# Altium schematic sheet Digital_Output.SchDoc: TTL Output Card
size Tabloid; Date: 05/10/2023; Engineer: Terry D. Schevker; Revision: 1.0; SheetNumber: 1; SheetTotal: 3
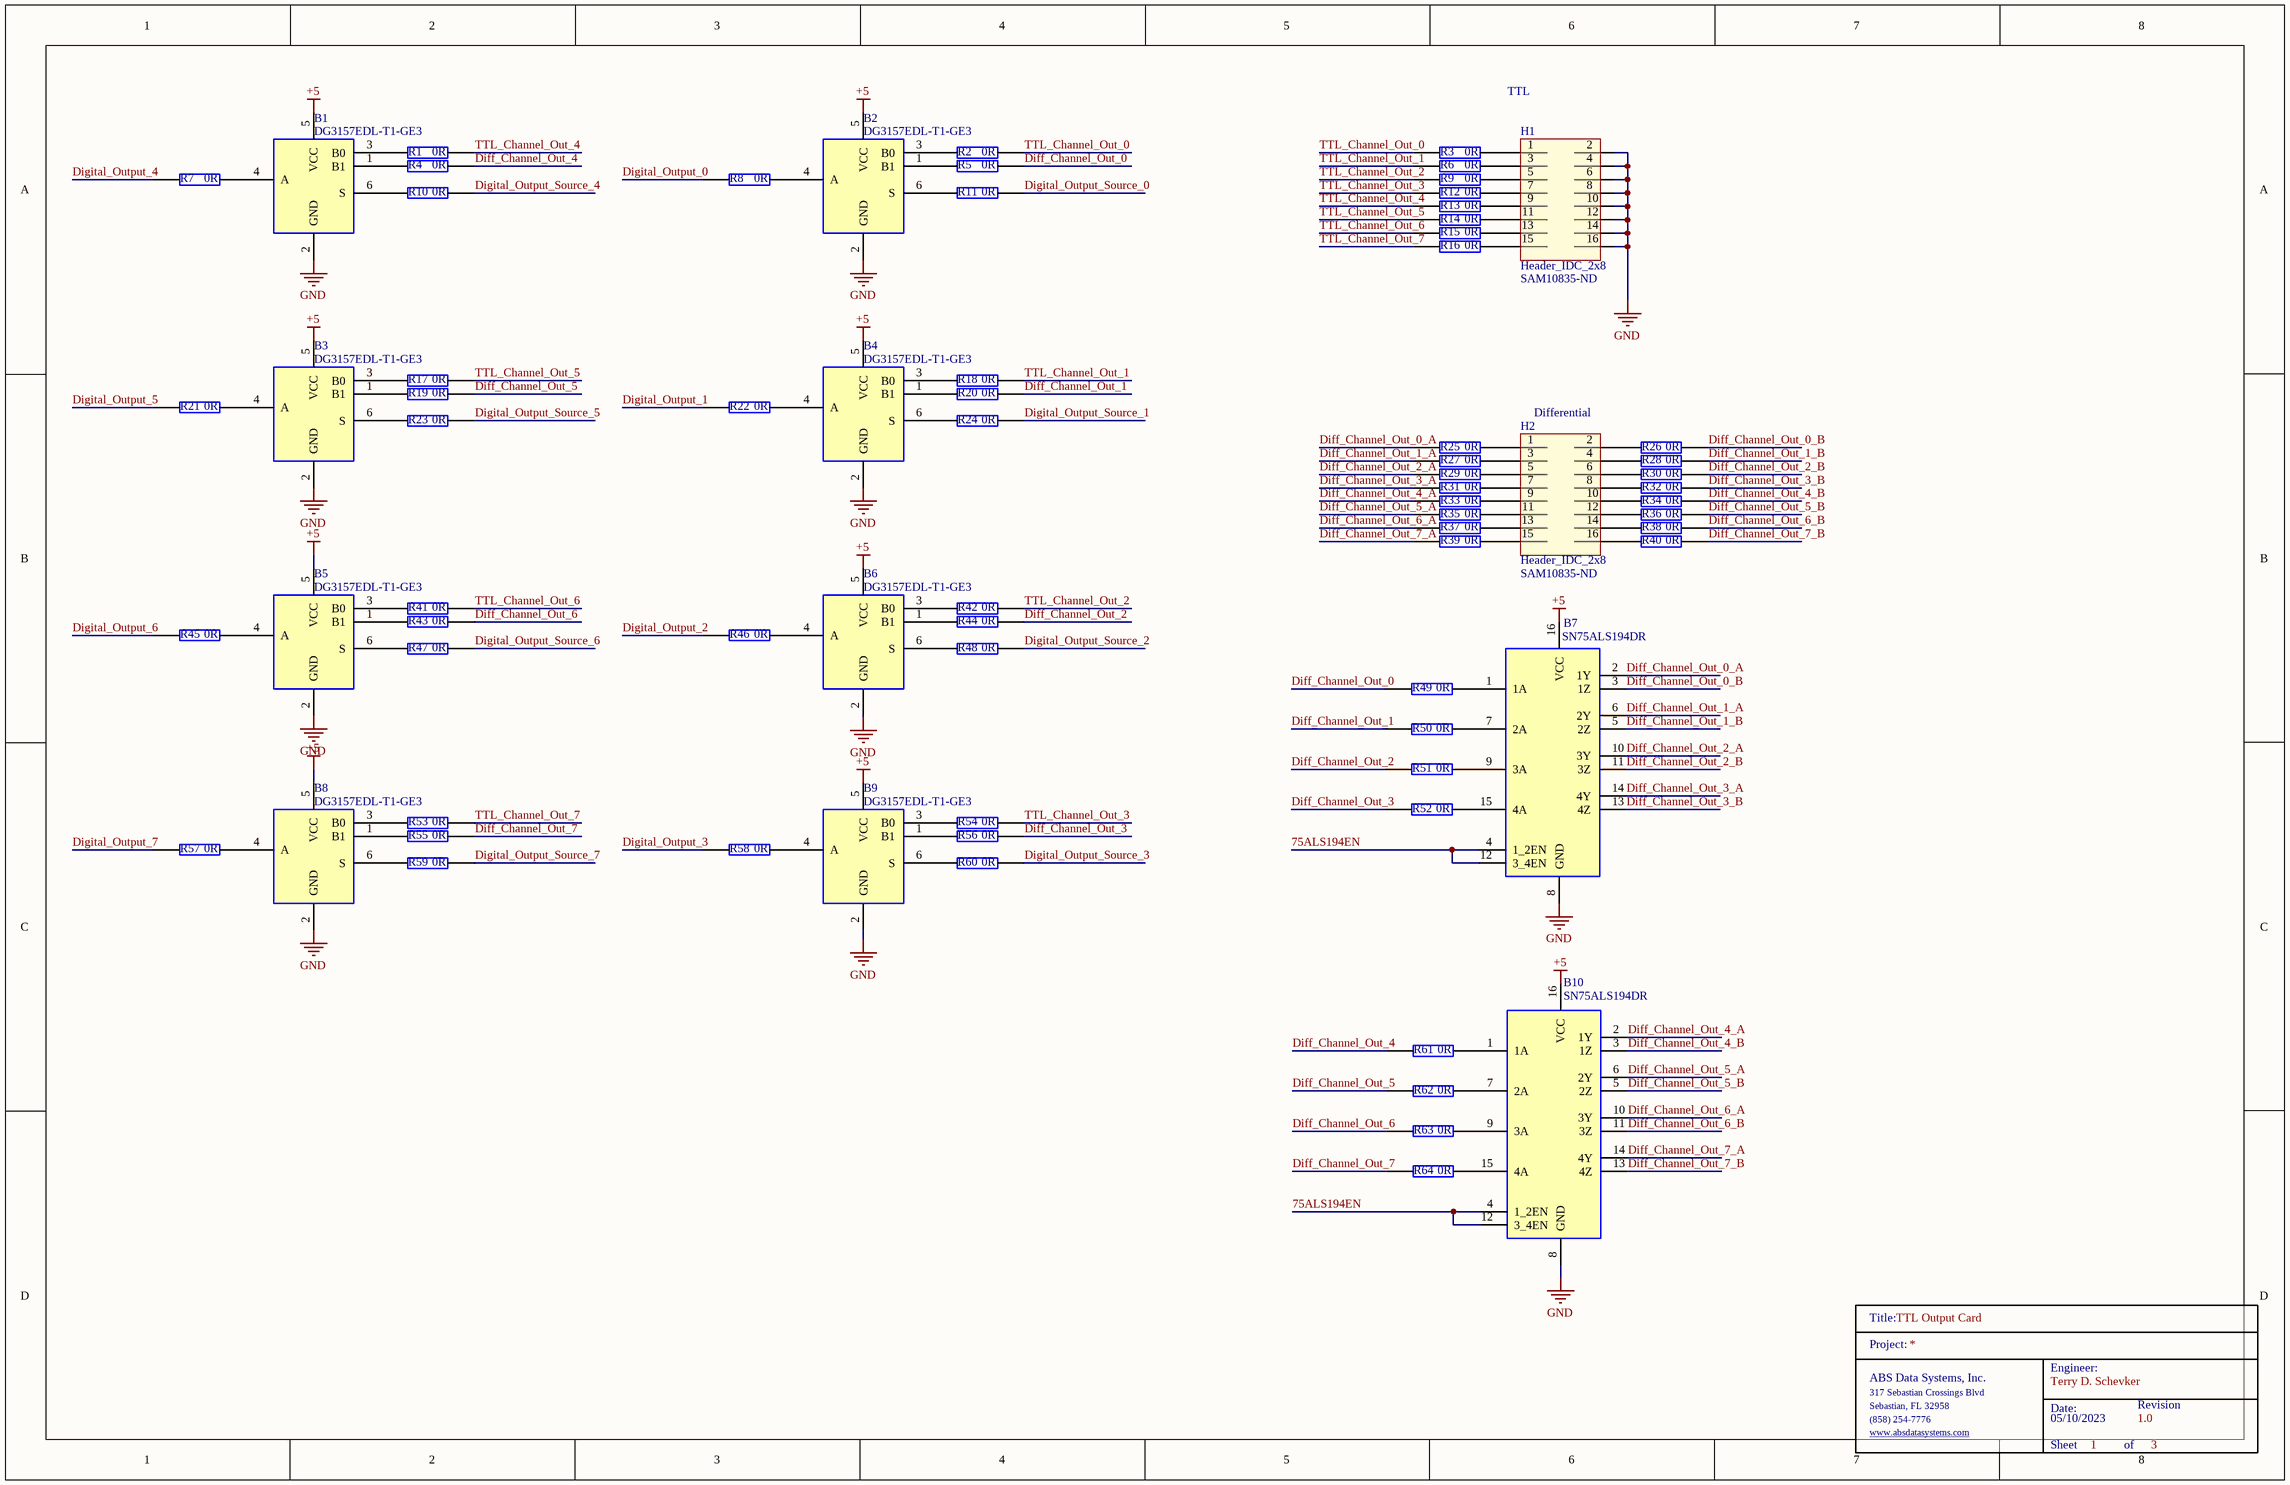
[diagram p0: Digital_Output.SchDoc]

## Parts
B1  DG3157EDL-T1-GE3  [SOT65P210X110-6N]
B2  DG3157EDL-T1-GE3  [SOT65P210X110-6N]
B3  DG3157EDL-T1-GE3  [SOT65P210X110-6N]
B4  DG3157EDL-T1-GE3  [SOT65P210X110-6N]
B5  DG3157EDL-T1-GE3  [SOT65P210X110-6N]
B6  DG3157EDL-T1-GE3  [SOT65P210X110-6N]
B7  SN75ALS194DR  [SOIC127P600X175-16N]
B8  DG3157EDL-T1-GE3  [SOT65P210X110-6N]
B9  DG3157EDL-T1-GE3  [SOT65P210X110-6N]
B10  SN75ALS194DR  [SOIC127P600X175-16N]
H1  Header_IDC_2x8  Supplier Part Number 1: SAM10835-ND  [HDR2X8]
H2  Header_IDC_2x8  Supplier Part Number 1: SAM10835-ND  [HDR2X8]
R1  0R  [0603]
R2  0R  [0603]
R3  0R  [0603]
R4  0R  [0603]
R5  0R  [0603]
R6  0R  [0603]
R7  0R  [0603]
R8  0R  [0603]
R9  0R  [0603]
R10  0R  [0603]
R11  0R  [0603]
R12  0R  [0603]
R13  0R  [0603]
R14  0R  [0603]
R15  0R  [0603]
R16  0R  [0603]
R17  0R  [0603]
R18  0R  [0603]
R19  0R  [0603]
R20  0R  [0603]
R21  0R  [0603]
R22  0R  [0603]
R23  0R  [0603]
R24  0R  [0603]
R25  0R  [0603]
R26  0R  [0603]
R27  0R  [0603]
R28  0R  [0603]
R29  0R  [0603]
R30  0R  [0603]
R31  0R  [0603]
R32  0R  [0603]
R33  0R  [0603]
R34  0R  [0603]
R35  0R  [0603]
R36  0R  [0603]
R37  0R  [0603]
R38  0R  [0603]
R39  0R  [0603]
R40  0R  [0603]
R41  0R  [0603]
R42  0R  [0603]
R43  0R  [0603]
R44  0R  [0603]
R45  0R  [0603]
R46  0R  [0603]
R47  0R  [0603]
R48  0R  [0603]
R49  0R  [0603]
R50  0R  [0603]
R51  0R  [0603]
R52  0R  [0603]
R53  0R  [0603]
R54  0R  [0603]
R55  0R  [0603]
R56  0R  [0603]
R57  0R  [0603]
R58  0R  [0603]
R59  0R  [0603]
R60  0R  [0603]
R61  0R  [0603]
R62  0R  [0603]
R63  0R  [0603]
R64  0R  [0603]
TitleBlock_3  TitleBlock  (value not drawn)  (graphical)

## Nets
+5: B1.5(VCC) B2.5(VCC) B3.5(VCC) B4.5(VCC) B5.5(VCC) B6.5(VCC) B7.16(VCC) B8.5(VCC) B9.5(VCC) B10.16(VCC)
GND: B1.2(GND) B2.2(GND) B3.2(GND) B4.2(GND) B5.2(GND) B6.2(GND) B7.8(GND) B8.2(GND) B9.2(GND) B10.8(GND) H1.2 H1.4 H1.6 H1.8 H1.10 H1.12 H1.14 H1.16
75ALS194EN: B7.4(1_2EN) B7.12(3_4EN) B10.4(1_2EN) B10.12(3_4EN)
Diff_Channel_Out_0: R5.2 R49.1
Diff_Channel_Out_0_A: B7.2(1Y) R25.1
Diff_Channel_Out_0_B: B7.3(1Z) R26.2
Diff_Channel_Out_1: R20.2 R50.1
Diff_Channel_Out_1_A: B7.6(2Y) R27.1
Diff_Channel_Out_1_B: B7.5(2Z) R28.2
Diff_Channel_Out_2: R44.2 R51.1
Diff_Channel_Out_2_A: B7.10(3Y) R29.1
Diff_Channel_Out_2_B: B7.11(3Z) R30.2
Diff_Channel_Out_3: R52.1 R56.2
Diff_Channel_Out_3_A: B7.14(4Y) R31.1
Diff_Channel_Out_3_B: B7.13(4Z) R32.2
Diff_Channel_Out_4: R4.2 R61.1
Diff_Channel_Out_4_A: B10.2(1Y) R33.1
Diff_Channel_Out_4_B: B10.3(1Z) R34.2
Diff_Channel_Out_5: R19.2 R62.1
Diff_Channel_Out_5_A: B10.6(2Y) R35.1
Diff_Channel_Out_5_B: B10.5(2Z) R36.2
Diff_Channel_Out_6: R43.2 R63.1
Diff_Channel_Out_6_A: B10.10(3Y) R37.1
Diff_Channel_Out_6_B: B10.11(3Z) R38.2
Diff_Channel_Out_7: R55.2 R64.1
Diff_Channel_Out_7_A: B10.14(4Y) R39.1
Diff_Channel_Out_7_B: B10.13(4Z) R40.2
Digital_Output_0: R8.1
Digital_Output_1: R22.1
Digital_Output_2: R46.1
Digital_Output_3: R58.1
Digital_Output_4: R7.1
Digital_Output_5: R21.1
Digital_Output_6: R45.1
Digital_Output_7: R57.1
Digital_Output_Source_0: R11.2
Digital_Output_Source_1: R24.2
Digital_Output_Source_2: R48.2
Digital_Output_Source_3: R60.2
Digital_Output_Source_4: R10.2
Digital_Output_Source_5: R23.2
Digital_Output_Source_6: R47.2
Digital_Output_Source_7: R59.2
TTL_Channel_Out_0: R2.2 R3.1
TTL_Channel_Out_1: R6.1 R18.2
TTL_Channel_Out_2: R9.1 R42.2
TTL_Channel_Out_3: R12.1 R54.2
TTL_Channel_Out_4: R1.2 R13.1
TTL_Channel_Out_5: R14.1 R17.2
TTL_Channel_Out_6: R15.1 R41.2
TTL_Channel_Out_7: R16.1 R53.2
NetB1_1: B1.1(B1) R4.1
NetB1_3: B1.3(B0) R1.1
NetB1_4: B1.4(A) R7.2
NetB1_6: B1.6(S) R10.1
NetB2_1: B2.1(B1) R5.1
NetB2_3: B2.3(B0) R2.1
NetB2_4: B2.4(A) R8.2
NetB2_6: B2.6(S) R11.1
NetB3_1: B3.1(B1) R19.1
NetB3_3: B3.3(B0) R17.1
NetB3_4: B3.4(A) R21.2
NetB3_6: B3.6(S) R23.1
NetB4_1: B4.1(B1) R20.1
NetB4_3: B4.3(B0) R18.1
NetB4_4: B4.4(A) R22.2
NetB4_6: B4.6(S) R24.1
NetB5_1: B5.1(B1) R43.1
NetB5_3: B5.3(B0) R41.1
NetB5_4: B5.4(A) R45.2
NetB5_6: B5.6(S) R47.1
NetB6_1: B6.1(B1) R44.1
NetB6_3: B6.3(B0) R42.1
NetB6_4: B6.4(A) R46.2
NetB6_6: B6.6(S) R48.1
NetB7_1: B7.1(1A) R49.2
NetB7_7: B7.7(2A) R50.2
NetB7_9: B7.9(3A) R51.2
NetB7_15: B7.15(4A) R52.2
NetB8_1: B8.1(B1) R55.1
NetB8_3: B8.3(B0) R53.1
NetB8_4: B8.4(A) R57.2
NetB8_6: B8.6(S) R59.1
NetB9_1: B9.1(B1) R56.1
NetB9_3: B9.3(B0) R54.1
NetB9_4: B9.4(A) R58.2
NetB9_6: B9.6(S) R60.1
NetB10_1: B10.1(1A) R61.2
NetB10_7: B10.7(2A) R62.2
NetB10_9: B10.9(3A) R63.2
NetB10_15: B10.15(4A) R64.2
NetH1_1: H1.1 R3.2
NetH1_3: H1.3 R6.2
NetH1_5: H1.5 R9.2
NetH1_7: H1.7 R12.2
NetH1_9: H1.9 R13.2
NetH1_11: H1.11 R14.2
NetH1_13: H1.13 R15.2
NetH1_15: H1.15 R16.2
NetH2_1: H2.1 R25.2
NetH2_2: H2.2 R26.1
NetH2_3: H2.3 R27.2
NetH2_4: H2.4 R28.1
NetH2_5: H2.5 R29.2
NetH2_6: H2.6 R30.1
NetH2_7: H2.7 R31.2
NetH2_8: H2.8 R32.1
NetH2_9: H2.9 R33.2
NetH2_10: H2.10 R34.1
NetH2_11: H2.11 R35.2
NetH2_12: H2.12 R36.1
NetH2_13: H2.13 R37.2
NetH2_14: H2.14 R38.1
NetH2_15: H2.15 R39.2
NetH2_16: H2.16 R40.1

## Notes on the sheet
- TTL
- Differential
- (in symbol TitleBlock) Title:; Project:; Engineer:; ABS Data Systems, Inc.; 317 Sebastian Crossings Blvd; Sebastian, FL 32958; Date:; Revision; (858) 254-7776; www.absdatasystems.com; Sheet; of

## Library data of the parts
B1-B6 B8 B9 = DG3157EDL-T1-GE3: Vishay DG3157EDL-T1-GE3 Analogue SPDT Switch 1.65 to 5.5 V, 6-Pin SC-70; Geometry.Height: 1.1mm; Mouser Part Number: 78-DG3157EDL-T1-GE3; Mouser Price/Stock: https://www.mouser.co.uk/ProductDetail/Vishay-Siliconix/DG3157EDL-T1-GE3?qs=fA06TrWLL4foa%252BeCWkw4dg%3D%3D; Manufacturer_Name: Vishay; Manufacturer_Part_Number: DG3157EDL-T1-GE3; Datasheet Link: https://eagle.componentsearchengine.com/Datasheets/2/DG3157EDL-T1-GE3.pdf
B7 B10 = SN75ALS194DR: Quadruple Differential Line Driver; Manufacturer_Name: Texas Instruments; Geometry.Height: 1.75mm; Mouser Part Number: 595-SN75ALS194DR; Mouser Price/Stock: https://www.mouser.co.uk/ProductDetail/Texas-Instruments/SN75ALS194DR?qs=o4busQjUnQZsKwe8Vn%2FFUg%3D%3D; Manufacturer_Part_Number: SN75ALS194DR; Datasheet Link: http://www.ti.com/lit/gpn/sn75als194
H1 H2 = Header_IDC_2x8: 16 Pin 2x8 Through Hold IDC Connector; Manufacturer: Samtec; Manufacturer Part Number: TST-108-01-G-D; Number of Contacts: 16; Gender: Male; Connector Type: Male Pin; Pitch: 2.54mm; Row Spacing: 0.1inch; Supplier 1: Digi-Key; RoHS: Yes; Category: Headers and Wire Housings; Stock 1: 227; Pricing 1: 1=2.85000, 10=2.73600, 100=2.28000, 500=1.93800, 1000=1.65300, 5000=1.48200 (USD); Mount: Through Hole; Contact Plating: Gold; Contact Material: Bronze; Housing Material: Polyester; Housing Color: Black; Color: Black; Min Operating Temperature: -55°C; Max Operating Temperature: 125°C; Number of Rows: 2; Termination: Solder; Packaging: Rail/Tube; Orientation: Straight; Number of Positions: 16; Length: 27.94mm; Depth: 9.27mm; Contact Mating Length: 0.25inch; REACH SVHC: No SVHC; ComponentLink1URL: https://datasheet.ciiva.com/739/tst-mkt-739845.pdf?src-supplier=Digi-Key; ComponentLink1Description: https://datasheet.ciiva.com/739/tst-mkt-739845.pdf?src-supplier=Digi-Key; ComponentLink2URL: https://datasheet.ciiva.com/10018/htst-10018510.pdf?src-supplier=Avnet; ComponentLink2Description: https://datasheet.ciiva.com/10018/htst-10018510.pdf?src-supplier=Avnet
R1-R64 = RC0603JR-070RL: YAGEO 0603 0 ohm; Manufacturer_Name: KEMET; Geometry.Height: 0.55mm; Mouser Part Number: 603-RC0603JR-070RL; Mouser Price/Stock: https://www.mouser.co.uk/ProductDetail/YAGEO/RC0603JR-070RL?qs=2cAdsCoAWRGWyPcuXgGiXQ%3D%3D; Manufacturer_Part_Number: RC0603JR-070RL; Datasheet Link: https://datasheet.datasheetarchive.com/originals/distributors/Datasheets_SAMA/902f9e387b938f871d31120f5fc1d65e.pdf